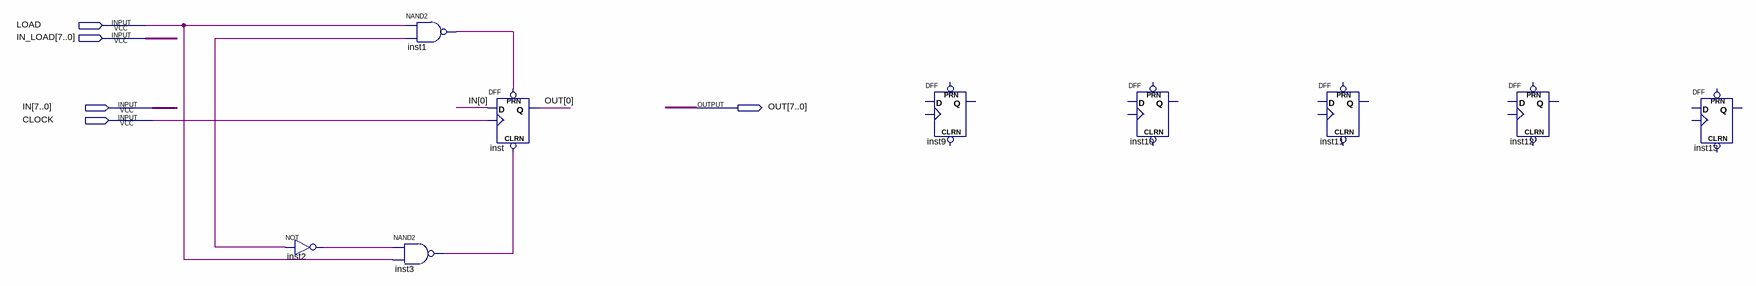
[diagram p0: schematic sheet]
// Quartus schematic Register_8bit Paulo.bdf as structural Verilog: 9 symbols, 5 pins
module \Register_8bit_Paulo  (
  input  LOAD,
  input  [7:0] IN_LOAD,
  input  [7:0] IN,
  input  CLOCK,
  output [7:0] OUT
);

  wire inst1_out, inst2_out, inst3_out, undriven;

  not inst2 (inst2_out, undriven);
  nand inst1 (inst1_out, LOAD, undriven);
  nand inst3 (inst3_out, inst2_out, LOAD);
  DFF inst (.CLRN(inst3_out), .CLK(CLOCK), .D(IN[0]), .PRN(inst1_out), .Q(OUT[0]));
  DFF inst9 ();  // open: CLRN, CLK, D, PRN, Q
  DFF inst10 ();  // open: CLRN, CLK, D, PRN, Q
  DFF inst11 ();  // open: CLRN, CLK, D, PRN, Q
  DFF inst12 ();  // open: CLRN, CLK, D, PRN, Q
  DFF inst13 ();  // open: CLRN, CLK, D, PRN, Q
endmodule
